# EAGLE design F1 (EAGLE 9.6.2)
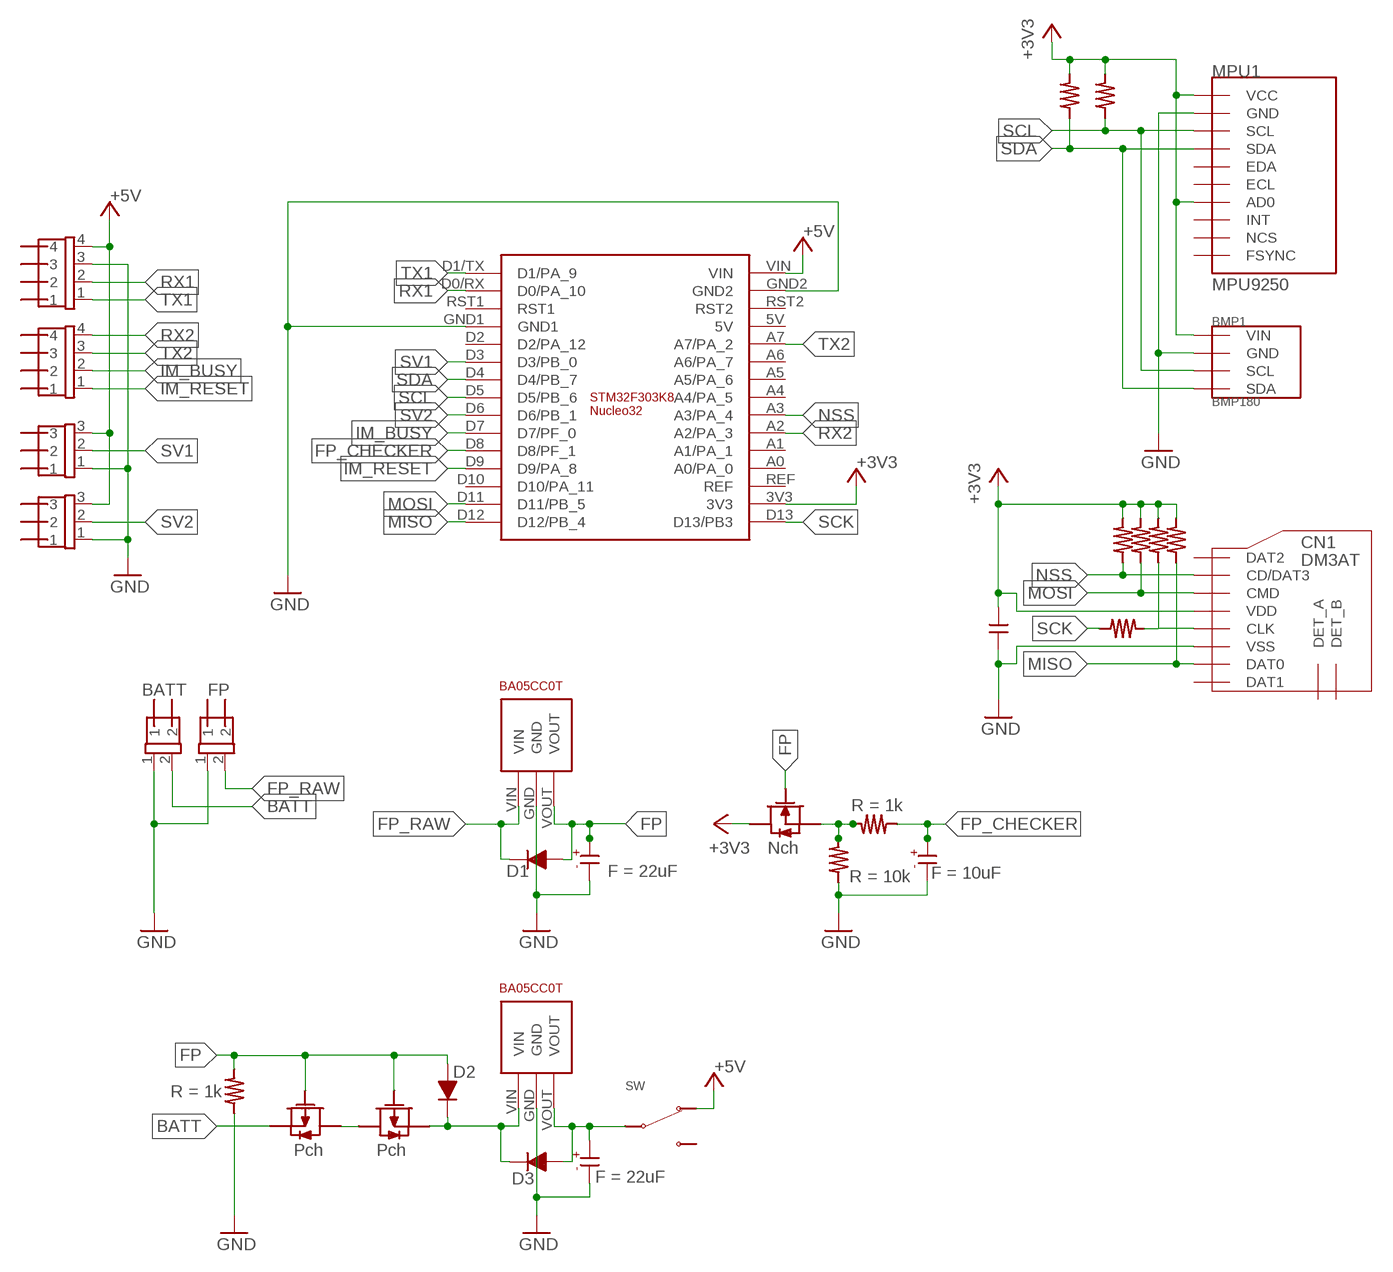
[diagram p0: schematic, sheet 1]

## Parts
BATT  2PIN  [2PIN]
BMP1  BMP180  [GY-68]
C1  22uF  CAPACITOR-ELECTROLYTIC_1  [CAPACITOR-ELECTROLYTIC_1]
C2  CAPACITOR-ELECTROLYTIC_1  [CAPACITOR-ELECTROLYTIC_1]
C3  CAPACITOR-ELECTROLYTIC_1  [CAPACITOR-ELECTROLYTIC_1]
C4  CAPACITOR-CERAMICC_1  [CAPACITOR-CERAMICC_1]
CN1  DM3AT  [DM3AT]
CONN1  4PIN  [4PIN]
CONN2  4PIN  [4PIN]
CONN3  3PIN  [3PIN]
CONN4  3PIN  [3PIN]
CP1  STM32F303K8-NUCLEO32  [STM32-NUCLEO32]
D1  DIODE  [DIODE]
FRIGHT-PIN  2PIN  [2PIN]
MPU1  MPU9250  [GY-9250]
R1  RESISTER  [REGISTER]
R2  RESISTER  [REGISTER]
R3  RESISTER  [REGISTER]
R4  RESISTER  [REGISTER]
R5  RESISTER  [REGISTER]
R6  RESISTER  [REGISTER]
R7  RESISTER  [REGISTER]
R8  RESISTER  [REGISTER]
R9  RESISTER  [REGISTER]
R10  RESISTER  [REGISTER]
REG1  BA05CC0T  [BA05CC0T]
REG2  BA05CC0T  [BA05CC0T]
SW1  SLIDE-SW_1  [SLIDE-SW]
U$1  DIODE  [DIODE]
U$2  2SJ681-PCH  [2SJ681]
U$3  2SJ681-PCH  [2SJ681]
U$4  DIODE  [DIODE]
U$5  2SK4017-NCH  [2SK4017]

## Nets
+3V3: BMP1.P1(VIN) C4.2 CN1.VDD CP1.3V3 MPU1.P1(VCC) MPU1.P7(AD0) R4.B R5.B R6.B R7.B R8.B R9.B U$5.DRAIN
+5V: CONN1.4 CONN3.3 CONN4.3 CP1.VIN SW1.LEFT
BATT: BATT.2 U$2.SOURCE
FP: C1.KS D1.A(ANODE) R1.B REG1.VOUT U$1.A(ANODE) U$2.GATE U$3.GATE U$5.GATE
FP_CHECKER: C3.KS CP1.D8(D8/PF_1) R3.A
FP_RAW: D1.K(KASODE) FRIGHT-PIN.2 REG1.VIN
GND: BATT.1 BMP1.P2(GND) C1.AN C2.AN C3.AN C4.1 CN1.VSS CONN1.3 CONN3.1 CONN4.1 CP1.GND1 CP1.GND2 FRIGHT-PIN.1 MPU1.P2(GND) R1.A R2.A REG1.GND REG2.GND
IM_BUSY: CONN2.2 CP1.D7(D7/PF_0)
IM_RESET: CONN2.1 CP1.D9(D9/PA_8)
MISO: CN1.DAT0 CP1.D12(D12/PB_4) R6.A
MOSI: CN1.CMD CP1.D11(D11/PB_5) R8.A
N$1: U$2.DRAIN U$3.DRAIN
N$2: REG2.VIN U$1.K(KASODE) U$3.SOURCE U$4.K(KASODE)
N$3: C2.KS REG2.VOUT SW1.CENTER U$4.A(ANODE)
N$5: R2.B R3.B U$5.SOURCE
N$6: CN1.CLK R7.A R10.B
NSS: CN1.CD/DAT3 CP1.A3(A3/PA_4) R9.A
RX1: CONN1.2 CP1.D0/RX(D0/PA_10)
RX2: CONN2.4 CP1.A2(A2/PA_3)
SCK: CP1.D13(D13/PB3) R10.A
SCL: BMP1.P3(SCL) CP1.D5(D5/PB_6) MPU1.P3(SCL) R4.A
SDA: BMP1.P4(SDA) CP1.D4(D4/PB_7) MPU1.P4(SDA) R5.A
SV1: CONN3.2 CP1.D3(D3/PB_0)
SV2: CONN4.2 CP1.D6(D6/PB_1)
TX1: CONN1.1 CP1.D1/TX(D1/PA_9)
TX2: CONN2.3 CP1.A7(A7/PA_2)
Unconnected: CN1.DAT1 CN1.DAT2 CN1.DET_A CN1.DET_B CP1.5V CP1.A0(A0/PA_0) CP1.A1(A1/PA_1) CP1.A4(A4/PA_5) CP1.A5(A5/PA_6) CP1.A6(A6/PA_7) CP1.D2(D2/PA_12) CP1.D10(D10/PA_11) CP1.REF CP1.RST1 CP1.RST2 MPU1.P5(EDA) MPU1.P6(ECL) MPU1.P8(INT) MPU1.P9(NCS) MPU1.P10(FSYNC) SW1.RIGHT

## Library data of the parts
BATT FRIGHT-PIN = 171822 connecter:2PIN
BMP1 = BMP180:BMP180
C1 C2 = normal capacitor:CAPACITOR-ELECTROLYTIC_1; F: 22uF
C3 = normal capacitor:CAPACITOR-ELECTROLYTIC_1; F: 10uF
C4 = normal capacitor:CAPACITOR-CERAMICC_1
CN1 = microSD:DM3AT
CONN1 CONN2 = 171822 connecter:4PIN
CONN3 CONN4 = 171822 connecter:3PIN
CP1 = STM32:STM32F303K8-NUCLEO32
D1 U$1 U$4 = normal diod:DIODE
MPU1 = MPU9250:MPU9250
R1 R3 = normal register:RESISTER; R: 1k
R2 = normal register:RESISTER; R: 10k
R4-R10 = normal register:RESISTER
REG1 REG2 = Regulator:BA05CC0T
SW1 = Switches:SLIDE-SW_1
U$2 U$3 = mosfet:2SJ681-PCH
U$5 = mosfet:2SK4017-NCH

## Board
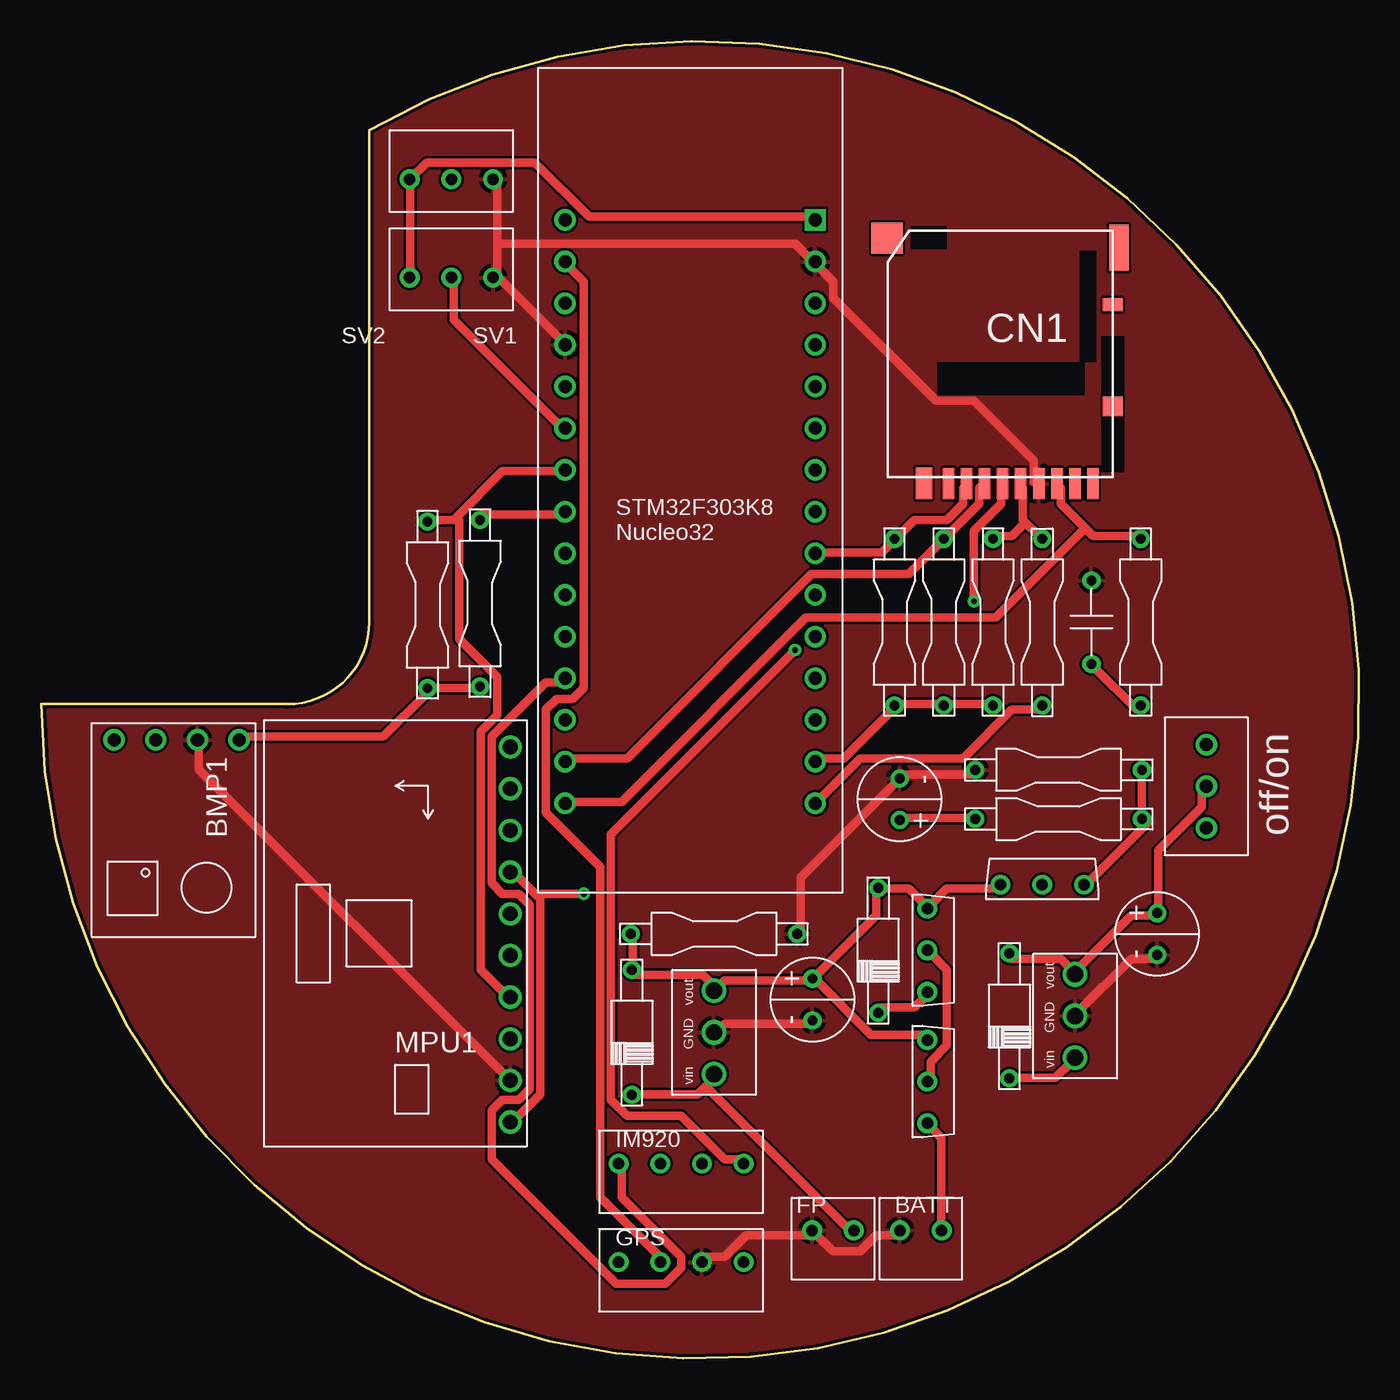
[diagram p1: board, top side]
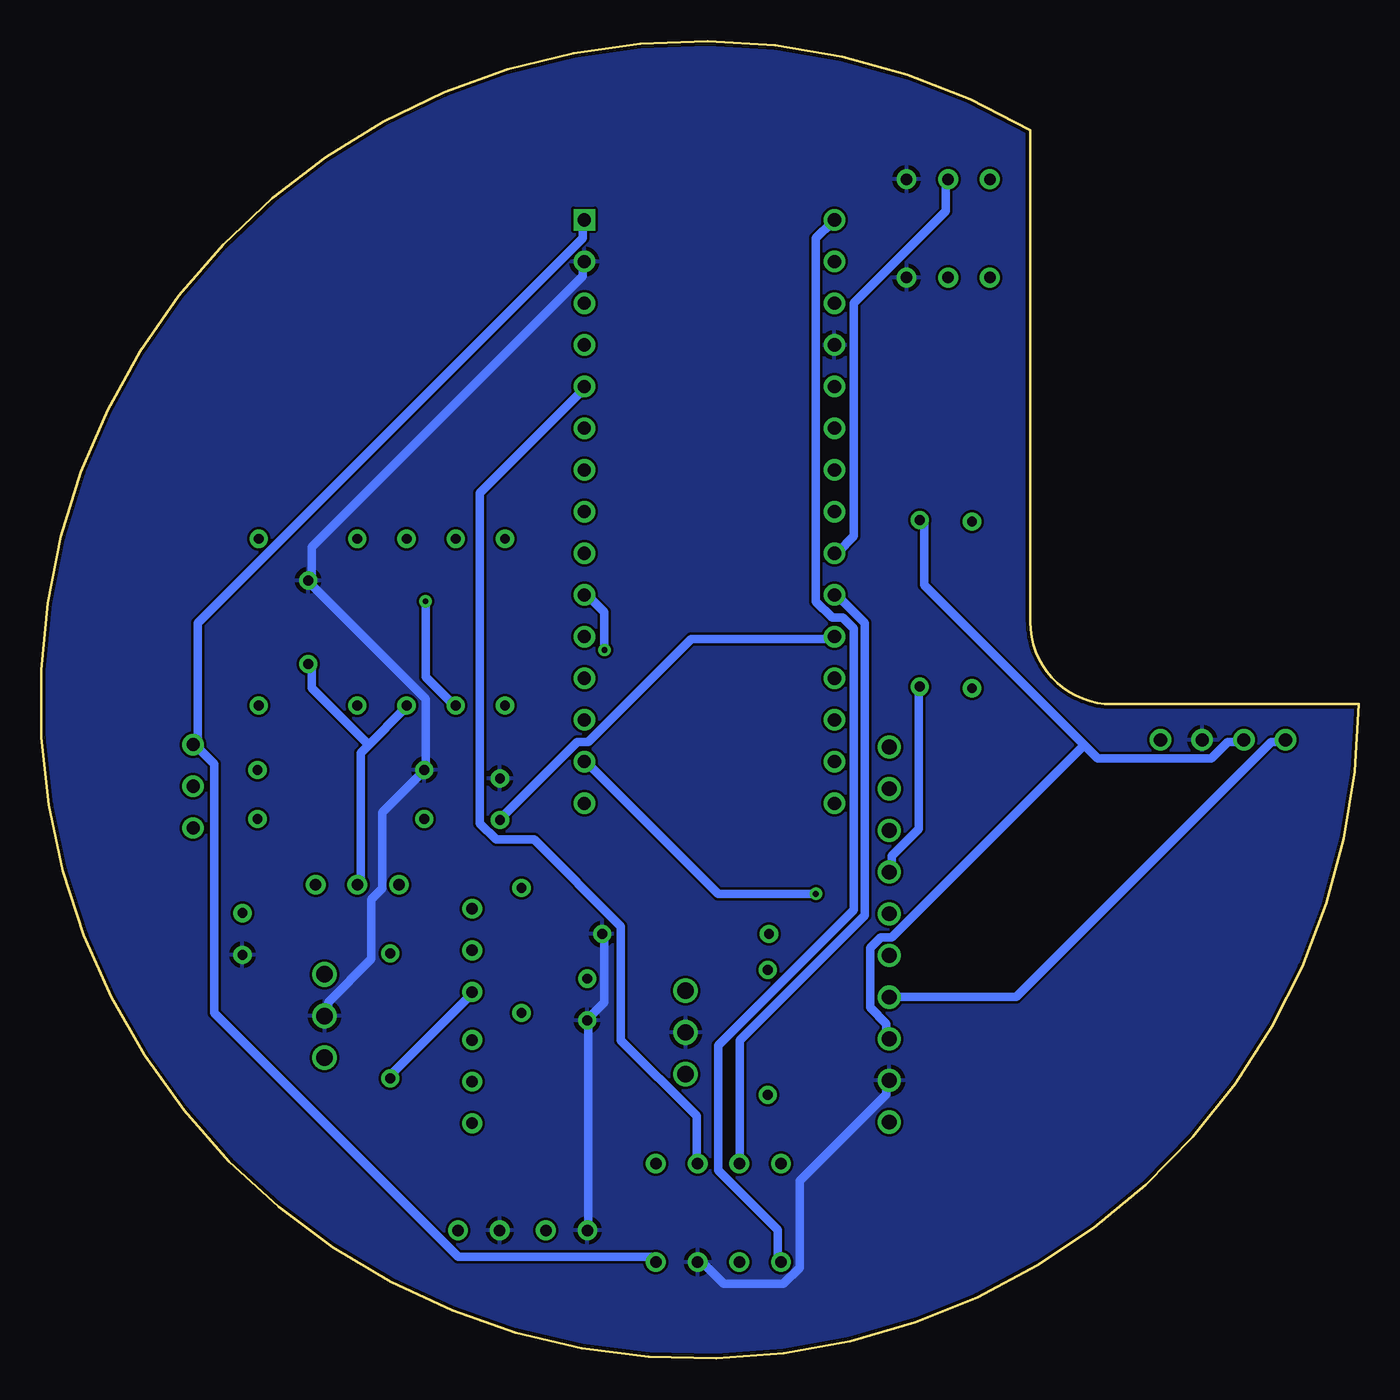
[diagram p2: board, bottom side, seen from below]

Size 80.27 x 80.3 mm. Coordinates in mm from the lower left corner, seen from the top.
Outline: 20,44.88 20,74.88 arc-300 0,39.88 15,39.88 arc90 20,44.88
Copper layers (1*16): Top 0.035mm / dielectric 1.5mm / Bottom 0.035mm
Design rules "PCBGoGo": minimum track width 6mil, minimum drill 0.2mm, track to track 6mil, track to pad 6mil, pad to pad 6mil, via to via 6mil, smd to smd 6mil, copper to edge 0.2mm, drill to drill 6mil, minimum pad ring 10mil, minimum via ring 8mil, stop-mask expansion 4mil, vias tented up to drill 0mil, thermal gap 10mil

### Footprints (pad centres in the part's own frame; a part is rotated, then mirrored left to right if it is on the bottom)
2PIN = drill 0.7: 1 -1.27,0; 2 1.27,0
GY-68 = drill 0.8: P1 -5,4; P2 -5,1.46; P3 -5,-1.08; P4 -5,-3.62
CAPACITOR-ELECTROLYTIC_1 = drill 0.6: AN -1.27,0; KS 1.27,0
CAPACITOR-CERAMICC_1 = drill 0.6: 1 -2.54,0; 2 2.54,0
DM3AT = smd 0.7 x 1.9: CD/DAT3 2.2,6.4; CLK -1.1,6.4; CMD 1.1,6.4; DAT0 -3.3,6.4; DAT1 -4.4,6.4; DAT2 3.3,6.4; DET_B -5.5,6.4; VDD 0,6.4; VSS -2.2,6.4 | smd 1.2 x 0.8: DET_A -6.7,-4.5 | smd 1 x 1.9: P$9 4.8,6.381 | smd 1.2 x 1.2: P$11 -6.7,1.7 | smd 1.2 x 2.8: P$13 -7.081,-7.973 | smd 1.9 x 1.9: P$14 7.054,-8.562
4PIN = drill 0.7: 1 -3.81,0; 2 -1.27,0; 3 1.27,0; 4 3.81,0
3PIN = drill 0.7: 1 -2.54,0; 2 0,0; 3 2.54,0
STM32-NUCLEO32 = drill 0.8: 3V3 8.001,-16.891; 5V 33.401,-16.891; A0 13.081,-16.891; A1 15.621,-16.891; A2 18.161,-16.891; A3 20.701,-16.891; A4 23.241,-16.891; A5 25.781,-16.891; A6 28.321,-16.891; A7 30.861,-16.891; D0/RX 38.481,-1.651; D1/TX 41.021,-1.651; D2 30.861,-1.651; D3 28.321,-1.651; D4 25.781,-1.651; D5 23.241,-1.651; D6 20.701,-1.651; D7 18.161,-1.651; D8 15.621,-1.651; D9 13.081,-1.651; D10 10.541,-1.651; D11 8.001,-1.651; D12 5.461,-1.651; D13 5.461,-16.891; GND1 33.401,-1.651; GND2 38.481,-16.891; REF 10.541,-16.891; RST1 35.941,-1.651; RST2 35.941,-16.891 | drill 0.8 square: VIN 41.021,-16.891
DIODE = drill 0.6: A 3.81,0; K -3.81,0
GY-9250 = drill 0.9: P1 -7,11.5; P2 -7,8.96; P3 -7,6.42; P4 -7,3.88; P5 -7,1.34; P6 -7,-1.2; P7 -7,-3.74; P8 -7,-6.28; P9 -7,-8.82; P10 -7,-11.36
REGISTER = drill 0.6: A -5.08,0; B 5.08,0
BA05CC0T = drill 1: GND 0,0; VIN -2.54,0; VOUT 2.54,0
SLIDE-SW = drill 0.8: CENTER 0,0; LEFT -2.54,0; RIGHT 2.54,0
2SJ681 = drill 0.7: DRAIN 0,0; GATE 2.54,0; SOURCE -2.54,0
2SK4017 = drill 0.7: DRAIN 0,0; GATE 2.54,0; SOURCE -2.54,0

### Placement (x,y rotation side)
BATT  53.6,7.81 0 top
BMP1  8.07,32.71 270 top
C1  47,21.88 90 top
C2  68,25.88 90 top
C3  52.31,34.09 270 top
C4  64,44.88 270 top
CN1  58.59,59.73 180 top
CONN1  39,5.88 0 top
CONN2  39,11.88 0 top
CONN3  25,65.88 180 top
CONN4  25,71.88 180 top
CP1  30.28,28.38 90 top
D1  36,19.88 90 top
FRIGHT-PIN  48.25,7.81 0 top
MPU1  21.59,25.91 180 top
R1  41,25.88 180 top
R2  62,35.88 0 top
R3  62,32.88 0 top
R4  26.74,46.03 270 top
R5  23.55,45.93 270 top
R6  67,44.88 270 top
R7  58,44.88 270 top
R8  55,44.88 270 top
R9  52,44.88 270 top
R10  61,44.88 90 top
REG1  41,19.88 90 top
REG2  63,20.88 90 top
SW1  71,34.88 270 top
U$1  51,24.88 90 top
U$2  54,16.88 90 top
U$3  54,24.88 90 top
U$4  59,20.88 90 top
U$5  61,28.88 180 top

### Tracks (layer width: path | path; a pad name or v marks a point on that pad's centre or on a via)
+3V3  (via drill 0.35)
  Top 0.508: 30.26,28.15 28.77,29.64 MPU1.P7 | 30.26,28.15 30.42,27.99 30.42,16.1 28.77,14.45 MPU1.P1 | R4.B 26.46,40.87 23.82,40.87 R5.B 23.49,40.54 20.85,37.89 12.26,37.89 BMP1.P1 | C4.2 64.11,42.19 66.75,39.55 R6.B | v56.84,46.15 56.84,50.44 58.49,52.09 58.49,53.08 CN1.VDD | R7.B 57.83,39.88 55.19,39.88 R8.B 54.86,39.88 52.22,39.88 R9.B 51.89,39.55 48.91,36.57 47.26,36.57 CP1.3V3 | v33.07,28.32 30.42,28.32 30.26,28.15
  Bottom 0.508: MPU1.P7 28.44,29.97 28.44,30.63 26.79,32.28 26.79,40.87 R4.B | v56.84,46.15 56.84,41.53 55.19,39.88 R8.B | 60.31,37.4 58.16,39.55 R7.B | 60.31,37.4 60.8,36.9 60.8,28.98 U$5.DRAIN | 60.31,37.4 63.77,40.87 63.77,42.19 C4.2 | v33.07,28.32 39.01,28.32 46.93,36.24 CP1.3V3
+5V
  Top 0.508: CONN3.3 22.5,65.96 22.5,71.57 CONN4.3 22.5,71.9 23.49,72.9 30.09,72.9 33.4,69.59 46.93,69.59 CP1.VIN
  Bottom 0.508: CONN1.4 42.97,6.2 54.86,6.2 69.72,21.05 69.72,36.24 70.71,37.23 SW1.LEFT 70.71,37.56 70.71,44.83 47.26,68.27 47.26,69.26 CP1.VIN
BATT
  Top 0.508: BATT.2 54.86,7.85 54.86,13.46 54.2,14.12 U$2.SOURCE
FP
  Top 0.508: U$5.GATE 58.16,28.65 55.19,28.65 54.2,27.66 U$3.GATE 53.87,27.66 52.88,28.65 51.23,28.65 U$1.A 50.9,28.65 50.9,27 47.26,23.37 C1.KS | R1.B 36.04,25.68 36.04,23.7 D1.A 36.04,23.37 40.33,23.37 40.99,22.71 REG1.VOUT 41.32,22.71 41.65,23.04 46.93,23.04 C1.KS | U$2.GATE 53.87,19.73 50.57,19.73 47.26,23.04 C1.KS
FP_CHECKER
  Top 0.508: C3.KS 52.55,32.94 56.84,32.94 R3.A
  Bottom 0.508: CP1.D8 32.08,43.84 40.66,43.84 46.93,37.56 47.59,37.56 52.22,32.94 C3.KS
FP_RAW
  Top 0.508: 40.49,16.6 40.99,17.09 REG1.VIN | 40.49,16.6 40,16.1 36.04,16.1 D1.K | 40.49,16.6 49.25,7.85 FRIGHT-PIN.2
GND
  Top 0.508: 27.78,67.94 27.78,71.57 CONN4.1 | 27.78,67.94 27.78,65.96 | 27.78,65.96 31.74,62 CP1.GND1 | 27.78,65.96 CONN3.1 | CN1.VSS 60.47,53.41 60.47,54.73 56.84,58.37 54.53,58.37 48.26,64.64 48.26,65.63 47.26,66.62 CP1.GND2 46.93,66.95 45.94,67.94 27.78,67.94 | BMP1.P2 9.62,37.56 9.62,35.91 28.44,17.09 MPU1.P2 | CONN1.3 40.33,6.2 41.65,6.2 42.97,7.52 46.93,7.52 FRIGHT-PIN.1 47.26,7.52 48.26,6.53 49.91,6.53 50.9,7.52 52.22,7.52 BATT.1 | C1.AN 46.93,20.39 41.65,20.39 41.32,20.06 REG1.GND | C2.AN 67.74,24.36 66.42,24.36 63.11,21.05 REG2.GND | R2.A 56.84,35.58 52.55,35.58 C3.AN 52.22,35.25 46.27,29.31 46.27,26.01 R1.A
  Bottom 0.508: R1.A 45.94,25.68 45.94,21.71 46.93,20.72 C1.AN 46.93,20.39 46.93,7.85 FRIGHT-PIN.1 | REG2.GND 62.78,21.05 62.78,21.71 60.14,24.36 60.14,27.99 59.48,28.65 59.48,33.27 57.17,35.58 R2.A 56.84,35.91 56.84,40.21 63.77,47.14 C4.1 63.77,47.47 63.77,49.45 47.26,65.96 47.26,66.62 CP1.GND2 | MPU1.P2 28.77,16.76 28.77,16.1 34.06,10.82 34.06,5.53 35.05,4.54 38.68,4.54 40,5.86 CONN1.3
  pour Bottom: -5,84.88 85,84.88 85,-5.12 -5,-5.12
  pour Top: -15,89.88 85,89.88 85,-10.12 -15,-10.12
IM_BUSY
  Bottom 0.508: CONN2.2 37.69,12.14 37.69,19.4 30.09,27 30.09,44.83 31.74,46.48 CP1.D7
IM_RESET
  Top 0.508: CONN2.1 35.38,11.81 35.38,9.83 39.01,6.2 39.01,5.53 38.02,4.54 35.05,4.54 27.45,12.14 27.45,15.11 28.11,15.77 29.1,15.77 29.76,16.43 29.76,27.66 29.1,28.32 28.11,28.32 27.45,28.98 27.45,37.89 30.75,41.2 31.74,41.2 CP1.D9
MISO
  Top 0.508: 63.61,50.61 64.11,50.11 66.75,50.11 R6.A | 63.61,50.61 62.12,52.09 62.12,53.08 CN1.DAT0 | 63.61,50.61 58.16,45.16 46.6,45.16 35.38,33.93 32.08,33.93 CP1.D12
MOSI
  Top 0.508: CN1.CMD 57.17,53.08 57.17,52.09 55.19,50.11 R8.A 54.86,49.78 52.88,47.8 46.93,47.8 35.71,36.57 32.08,36.57 CP1.D11
N$1
  Top 0.508: U$2.DRAIN 54.2,17.09 54.2,18.08 55.19,19.07 55.19,23.7 54.2,24.69 U$3.DRAIN
N$2
  Top 0.508: U$1.K 51.23,21.38 53.21,21.38 53.87,22.04 U$3.SOURCE | U$4.K 59.15,17.09 61.79,17.09 62.78,18.08 REG2.VIN
  Bottom 0.508: U$3.SOURCE 54.2,22.04 59.15,17.09 U$4.K
N$3
  Top 0.508: U$4.A 59.15,24.36 62.12,24.36 62.78,23.7 REG2.VOUT 63.11,23.7 66.42,27 67.74,27 C2.KS 68.07,27.33 68.07,30.96 70.71,33.6 70.71,34.59 SW1.CENTER
N$5
  Top 0.508: R2.B 67.08,35.58 67.08,32.94 R3.B 67.41,32.61 63.77,28.98 U$5.SOURCE
N$6
  Top 0.508: 59.98,50.94 60.8,50.11 R10.B | 59.98,50.94 59.81,51.1 59.81,53.08 CN1.CLK | 59.98,50.94 59.15,50.11 58.16,50.11 R7.A
NSS
  Top 0.508: CN1.CD/DAT3 56.18,53.08 56.18,52.09 55.19,51.1 53.21,51.1 52.22,50.11 R9.A 51.89,49.78 51.23,49.12 47.26,49.12 CP1.A3
RX1
  Top 0.508: CONN1.2 37.69,6.2 34.06,9.83 34.06,29.97 30.75,33.27 30.75,39.55 31.41,40.21 32.41,40.21 33.07,40.87 33.07,65.63 32.08,66.62 CP1.D0/RX
RX2  (via drill 0.35)
  Top 0.508: v45.94,43.18 34.72,31.95 34.72,15.77 35.71,14.78 39.01,14.78 41.65,12.14 42.64,12.14 CONN2.4
  Bottom 0.508: v45.94,43.18 45.94,45.49 46.93,46.48 CP1.A2
SCK
  Top 0.508: R10.A 60.8,39.55 59.15,39.55 56.18,36.57 49.91,36.57 47.26,33.93 CP1.D13
SCL
  Top 0.508: R4.A 26.79,51.43 31.74,51.43 CP1.D5
  Bottom 0.508: 16.72,37.4 26.46,47.14 26.46,51.1 R4.A | 16.72,37.4 15.89,36.57 8.96,36.57 7.97,37.56 7.31,37.56 BMP1.P3 | 16.72,37.4 28.44,25.68 29.1,25.68 29.76,25.02 29.76,21.38 28.77,20.39 28.77,19.73 MPU1.P3
SDA
  Top 0.508: 25.31,51.27 28.11,54.07 31.74,54.07 CP1.D4 | 25.31,51.27 25.14,51.1 23.82,51.1 R5.A | 25.31,51.27 25.47,51.1 25.47,43.84 27.78,41.53 27.78,39.22 26.79,38.22 26.79,23.7 28.44,22.04 MPU1.P4
  Bottom 0.508: BMP1.P4 4.67,37.56 5.33,37.56 20.85,22.04 28.44,22.04 MPU1.P4
SV1
  Top 0.508: CONN3.2 25.14,65.63 25.14,63.32 31.74,56.72 CP1.D3
SV2
  Bottom 0.508: CONN4.2 25.14,71.57 25.14,69.92 30.75,64.31 30.75,50.11 31.74,49.12 CP1.D6
TX1
  Bottom 0.508: CONN1.1 35.38,6.2 35.38,7.85 39.01,11.48 39.01,19.07 30.75,27.33 30.75,44.5 31.41,45.16 32.08,45.16 33.07,46.15 33.07,68.27 32.08,69.26 CP1.D1/TX
TX2
  Bottom 0.508: CONN2.3 40.33,12.14 40.33,14.78 44.95,19.4 44.95,26.34 50.24,31.62 52.55,31.62 53.54,32.61 53.54,52.75 47.26,59.03 CP1.A7

### Text on the board
tPlace: SV2 | SV1 | STM32F303K8 / Nucleo32 | off/on | IM920 | FP | BATT | GPS